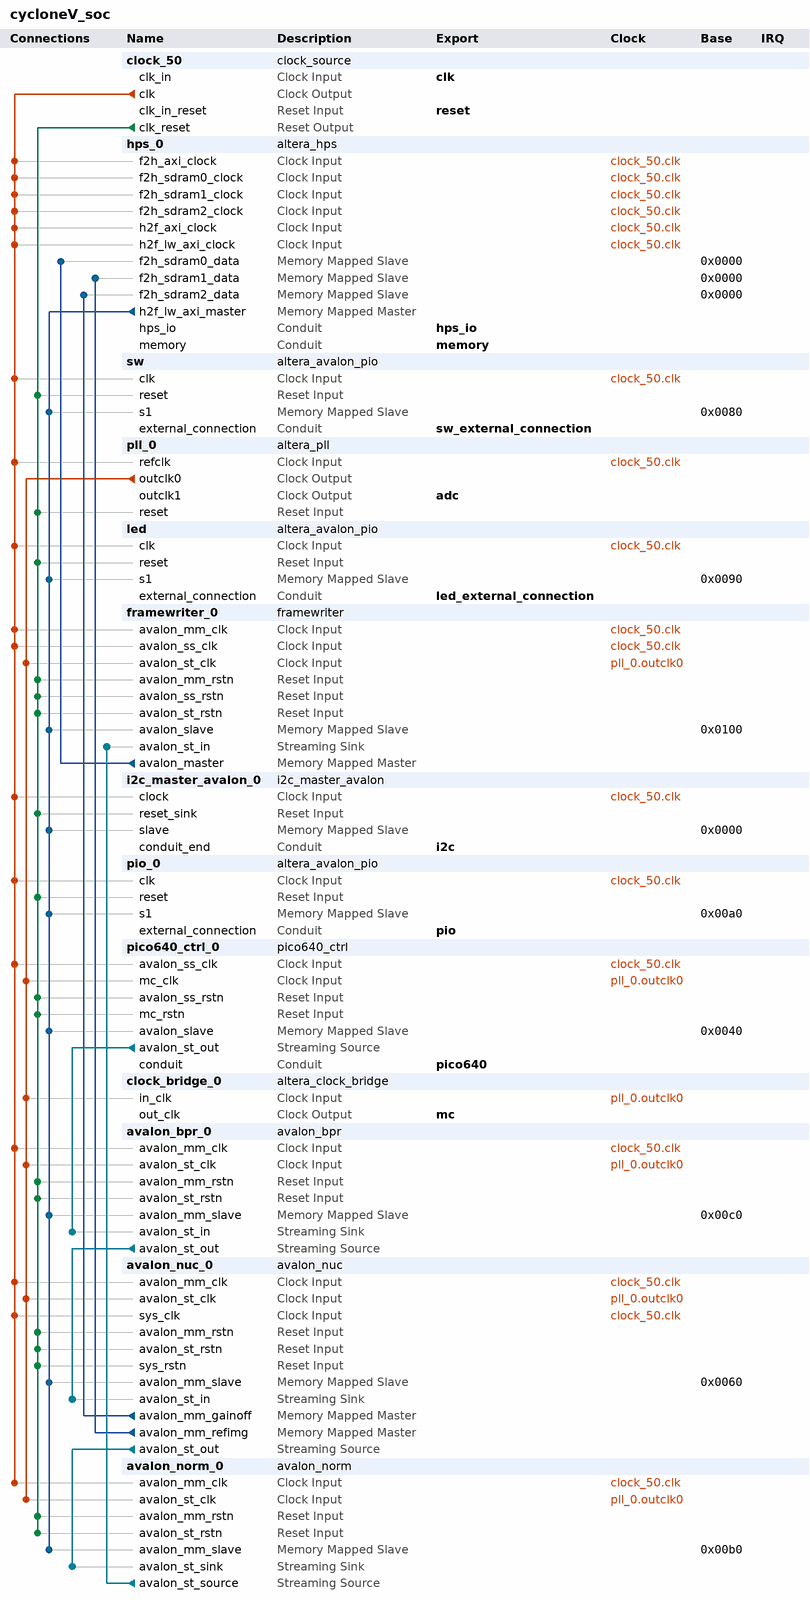
[diagram p0: system contents]
# Platform Designer (Qsys) system cycloneV_soc, Cyclone V 5CSEMA4U23C6
# Parameters at their usual value, and those the tool derives, are not listed.
package require -exact qsys 16.1
create_system cycloneV_soc
set_project_property DEVICE_FAMILY {Cyclone V}
set_project_property DEVICE 5CSEMA4U23C6

add_instance clock_50 clock_source 16.1
set_instance_parameter_value clock_50 clockFrequency 50000000

add_instance hps_0 altera_hps 16.1
set_instance_parameter_value hps_0 EMAC1_Mode RGMII
set_instance_parameter_value hps_0 EMAC1_PinMuxing {HPS I/O Set 0}
set_instance_parameter_value hps_0 F2SCLK_COLDRST_Enable false
set_instance_parameter_value hps_0 F2SCLK_DBGRST_Enable false
set_instance_parameter_value hps_0 F2SCLK_WARMRST_Enable false
set_instance_parameter_value hps_0 F2SDRAM_Type {Avalon-MM Write-Only,Avalon-MM Read-Only,Avalon-MM Read-Only}
set_instance_parameter_value hps_0 F2SDRAM_Width 64,64,64
set_instance_parameter_value hps_0 F2SINTERRUPT_Enable false
set_instance_parameter_value hps_0 F2S_Width 3
set_instance_parameter_value hps_0 FPGA_PERIPHERAL_OUTPUT_CLOCK_FREQ_EMAC0_GTX_CLK 100
set_instance_parameter_value hps_0 FPGA_PERIPHERAL_OUTPUT_CLOCK_FREQ_EMAC0_MD_CLK 100.0
set_instance_parameter_value hps_0 FPGA_PERIPHERAL_OUTPUT_CLOCK_FREQ_EMAC1_GTX_CLK 100
set_instance_parameter_value hps_0 FPGA_PERIPHERAL_OUTPUT_CLOCK_FREQ_EMAC1_MD_CLK 100.0
set_instance_parameter_value hps_0 HPS_PROTOCOL DDR3
set_instance_parameter_value hps_0 I2C0_Mode N/A
set_instance_parameter_value hps_0 I2C0_PinMuxing Unused
set_instance_parameter_value hps_0 I2C1_Mode N/A
set_instance_parameter_value hps_0 I2C1_PinMuxing Unused
set_instance_parameter_value hps_0 LWH2F_Enable true
set_instance_parameter_value hps_0 MEM_BANKADDR_WIDTH 3
set_instance_parameter_value hps_0 MEM_CLK_FREQ 400.0
set_instance_parameter_value hps_0 MEM_COL_ADDR_WIDTH 10
set_instance_parameter_value hps_0 MEM_DQ_WIDTH 32
set_instance_parameter_value hps_0 MEM_DRV_STR RZQ/7
set_instance_parameter_value hps_0 MEM_ROW_ADDR_WIDTH 15
set_instance_parameter_value hps_0 MEM_RTT_NOM RZQ/4
set_instance_parameter_value hps_0 MEM_RTT_WR {Dynamic ODT off}
set_instance_parameter_value hps_0 MEM_TCL 11
set_instance_parameter_value hps_0 MEM_TFAW_NS 30.0
set_instance_parameter_value hps_0 MEM_TRAS_NS 35.0
set_instance_parameter_value hps_0 MEM_TRCD_NS 13.75
set_instance_parameter_value hps_0 MEM_TRFC_NS 260.0
set_instance_parameter_value hps_0 MEM_TRP_NS 13.75
set_instance_parameter_value hps_0 MEM_VENDOR JEDEC
set_instance_parameter_value hps_0 MEM_WTCL 8
set_instance_parameter_value hps_0 QSPI_Mode N/A
set_instance_parameter_value hps_0 QSPI_PinMuxing Unused
set_instance_parameter_value hps_0 REF_CLK_FREQ 25.0
set_instance_parameter_value hps_0 S2FCLK_USER2CLK 5
set_instance_parameter_value hps_0 S2F_Width 2
set_instance_parameter_value hps_0 SDIO_Mode {4-bit Data}
set_instance_parameter_value hps_0 SDIO_PinMuxing {HPS I/O Set 0}
set_instance_parameter_value hps_0 SPIM1_Mode N/A
set_instance_parameter_value hps_0 SPIM1_PinMuxing Unused
set_instance_parameter_value hps_0 STM_Enable false
set_instance_parameter_value hps_0 TIMING_BOARD_AC_SKEW 0.03
set_instance_parameter_value hps_0 TIMING_BOARD_AC_TO_CK_SKEW 0.0
set_instance_parameter_value hps_0 TIMING_BOARD_DQ_TO_DQS_SKEW 0.0
set_instance_parameter_value hps_0 TIMING_BOARD_MAX_CK_DELAY 0.03
set_instance_parameter_value hps_0 TIMING_BOARD_MAX_DQS_DELAY 0.02
set_instance_parameter_value hps_0 TIMING_BOARD_SKEW_BETWEEN_DQS 0.08
set_instance_parameter_value hps_0 TIMING_BOARD_SKEW_CKDQS_DIMM_MAX 0.16
set_instance_parameter_value hps_0 TIMING_BOARD_SKEW_CKDQS_DIMM_MIN 0.09
set_instance_parameter_value hps_0 TIMING_BOARD_SKEW_WITHIN_DQS 0.01
set_instance_parameter_value hps_0 TIMING_TDH 65
set_instance_parameter_value hps_0 TIMING_TDQSCK 255
set_instance_parameter_value hps_0 TIMING_TDQSQ 125
set_instance_parameter_value hps_0 TIMING_TDS 30
set_instance_parameter_value hps_0 TIMING_TIH 140
set_instance_parameter_value hps_0 TIMING_TIS 180
set_instance_parameter_value hps_0 TIMING_TQSH 0.4
set_instance_parameter_value hps_0 UART0_Mode {No Flow Control}
set_instance_parameter_value hps_0 UART0_PinMuxing {HPS I/O Set 0}
set_instance_parameter_value hps_0 USB1_Mode SDR
set_instance_parameter_value hps_0 USB1_PinMuxing {HPS I/O Set 0}
set_instance_parameter_value hps_0 desired_cfg_clk_mhz 100.0
set_instance_parameter_value hps_0 desired_qspi_clk_mhz 400.0

add_instance sw altera_avalon_pio 16.1
set_instance_parameter_value sw direction Input
set_instance_parameter_value sw width 4

add_instance pll_0 altera_pll 16.1
set_instance_parameter_value pll_0 gui_device_speed_grade 2
set_instance_parameter_value pll_0 gui_number_of_clocks 2
set_instance_parameter_value pll_0 gui_operation_mode direct
set_instance_parameter_value pll_0 gui_output_clock_frequency0 38.0
set_instance_parameter_value pll_0 gui_output_clock_frequency1 19.0
set_instance_parameter_value pll_0 gui_phase_shift1 -9579
set_instance_parameter_value pll_0 gui_phase_shift_deg1 -12.0
set_instance_parameter_value pll_0 gui_pll_mode {Integer-N PLL}
set_instance_parameter_value pll_0 gui_ps_units1 degrees
set_instance_parameter_value pll_0 gui_reference_clock_frequency 50.0
set_instance_parameter_value pll_0 gui_use_locked false

add_instance led altera_avalon_pio 16.1
set_instance_parameter_value led direction Output
set_instance_parameter_value led width 8

add_instance framewriter_0 framewriter 1.0
set_instance_parameter_value framewriter_0 BURST_LENGTH_DEPTH 5
set_instance_parameter_value framewriter_0 CLOCK_FREQ 50000000
set_instance_parameter_value framewriter_0 FIFO_DEPTH 10
set_instance_parameter_value framewriter_0 NBITS_DATA 16

add_instance i2c_master_avalon_0 i2c_master_avalon 1.0
set_instance_parameter_value i2c_master_avalon_0 CHECK_ACK true
set_instance_parameter_value i2c_master_avalon_0 CLOCK_FREQ 50000000
set_instance_parameter_value i2c_master_avalon_0 I2C_CLK_FREQ 200000

add_instance pio_0 altera_avalon_pio 16.1
set_instance_parameter_value pio_0 direction Output
set_instance_parameter_value pio_0 width 8

add_instance pico640_ctrl_0 pico640_ctrl 1.0
set_instance_parameter_value pico640_ctrl_0 SENSOR_CLOCK 38000000

add_instance clock_bridge_0 altera_clock_bridge 16.1
set_instance_parameter_value clock_bridge_0 DERIVED_CLOCK_RATE 38000000
set_instance_parameter_value clock_bridge_0 EXPLICIT_CLOCK_RATE 12000000

add_instance avalon_bpr_0 avalon_bpr 1.0
set_instance_parameter_value avalon_bpr_0 MAXIMUM_BPS 1024
set_instance_parameter_value avalon_bpr_0 NBITS_DATA 16

add_instance avalon_nuc_0 avalon_nuc 1.0
set_instance_parameter_value avalon_nuc_0 ADDR_BASE_READ 939524096
set_instance_parameter_value avalon_nuc_0 BURST 32
set_instance_parameter_value avalon_nuc_0 DIV_APPROXIMATION true
set_instance_parameter_value avalon_nuc_0 FIFO_DEPTH_BITS 8
set_instance_parameter_value avalon_nuc_0 FRAME_SIZE 307200
set_instance_parameter_value avalon_nuc_0 NBITS_DATA 16

add_instance avalon_norm_0 avalon_norm 1.1
set_instance_parameter_value avalon_norm_0 FRAME_SIZE 307200
set_instance_parameter_value avalon_norm_0 HISTOGRAM_CAPABLE true
set_instance_parameter_value avalon_norm_0 HIST_ARRAY_BITS 6
set_instance_parameter_value avalon_norm_0 NBITS_DATA_IN 16
set_instance_parameter_value avalon_norm_0 NBITS_DATA_OUT 16
set_instance_parameter_value avalon_norm_0 NBITS_HISTOGRAM_DEPTH 19
set_instance_parameter_value avalon_norm_0 NORM_FSCALE_DEPTH 16
set_instance_parameter_value avalon_norm_0 NORM_MEMORY 16

# connections
add_connection clock_50.clk avalon_bpr_0.avalon_mm_clk clock
add_connection clock_50.clk avalon_norm_0.avalon_mm_clk clock
add_connection clock_50.clk avalon_nuc_0.avalon_mm_clk clock
add_connection clock_50.clk avalon_nuc_0.sys_clk clock
add_connection clock_50.clk framewriter_0.avalon_mm_clk clock
add_connection clock_50.clk framewriter_0.avalon_ss_clk clock
add_connection clock_50.clk hps_0.f2h_axi_clock clock
add_connection clock_50.clk hps_0.f2h_sdram0_clock clock
add_connection clock_50.clk hps_0.f2h_sdram1_clock clock
add_connection clock_50.clk hps_0.f2h_sdram2_clock clock
add_connection clock_50.clk hps_0.h2f_axi_clock clock
add_connection clock_50.clk hps_0.h2f_lw_axi_clock clock
add_connection clock_50.clk i2c_master_avalon_0.clock clock
add_connection clock_50.clk led.clk clock
add_connection clock_50.clk pico640_ctrl_0.avalon_ss_clk clock
add_connection clock_50.clk pio_0.clk clock
add_connection clock_50.clk pll_0.refclk clock
add_connection clock_50.clk sw.clk clock
add_connection pll_0.outclk0 avalon_bpr_0.avalon_st_clk clock
add_connection pll_0.outclk0 avalon_norm_0.avalon_st_clk clock
add_connection pll_0.outclk0 avalon_nuc_0.avalon_st_clk clock
add_connection pll_0.outclk0 clock_bridge_0.in_clk clock
add_connection pll_0.outclk0 framewriter_0.avalon_st_clk clock
add_connection pll_0.outclk0 pico640_ctrl_0.mc_clk clock
add_connection clock_50.clk_reset avalon_bpr_0.avalon_mm_rstn reset
add_connection clock_50.clk_reset avalon_bpr_0.avalon_st_rstn reset
add_connection clock_50.clk_reset avalon_norm_0.avalon_mm_rstn reset
add_connection clock_50.clk_reset avalon_norm_0.avalon_st_rstn reset
add_connection clock_50.clk_reset avalon_nuc_0.avalon_mm_rstn reset
add_connection clock_50.clk_reset avalon_nuc_0.avalon_st_rstn reset
add_connection clock_50.clk_reset avalon_nuc_0.sys_rstn reset
add_connection clock_50.clk_reset framewriter_0.avalon_mm_rstn reset
add_connection clock_50.clk_reset framewriter_0.avalon_ss_rstn reset
add_connection clock_50.clk_reset framewriter_0.avalon_st_rstn reset
add_connection clock_50.clk_reset i2c_master_avalon_0.reset_sink reset
add_connection clock_50.clk_reset led.reset reset
add_connection clock_50.clk_reset pico640_ctrl_0.avalon_ss_rstn reset
add_connection clock_50.clk_reset pico640_ctrl_0.mc_rstn reset
add_connection clock_50.clk_reset pio_0.reset reset
add_connection clock_50.clk_reset pll_0.reset reset
add_connection clock_50.clk_reset sw.reset reset
add_connection avalon_nuc_0.avalon_mm_gainoff hps_0.f2h_sdram2_data avalon
set_connection_parameter_value avalon_nuc_0.avalon_mm_gainoff/hps_0.f2h_sdram2_data baseAddress 0x0000
add_connection avalon_nuc_0.avalon_mm_refimg hps_0.f2h_sdram1_data avalon
set_connection_parameter_value avalon_nuc_0.avalon_mm_refimg/hps_0.f2h_sdram1_data baseAddress 0x0000
add_connection framewriter_0.avalon_master hps_0.f2h_sdram0_data avalon
set_connection_parameter_value framewriter_0.avalon_master/hps_0.f2h_sdram0_data baseAddress 0x0000
add_connection hps_0.h2f_lw_axi_master avalon_bpr_0.avalon_mm_slave avalon
set_connection_parameter_value hps_0.h2f_lw_axi_master/avalon_bpr_0.avalon_mm_slave baseAddress 0x00c0
add_connection hps_0.h2f_lw_axi_master avalon_norm_0.avalon_mm_slave avalon
set_connection_parameter_value hps_0.h2f_lw_axi_master/avalon_norm_0.avalon_mm_slave baseAddress 0x00b0
add_connection hps_0.h2f_lw_axi_master avalon_nuc_0.avalon_mm_slave avalon
set_connection_parameter_value hps_0.h2f_lw_axi_master/avalon_nuc_0.avalon_mm_slave baseAddress 0x0060
add_connection hps_0.h2f_lw_axi_master framewriter_0.avalon_slave avalon
set_connection_parameter_value hps_0.h2f_lw_axi_master/framewriter_0.avalon_slave baseAddress 0x0100
add_connection hps_0.h2f_lw_axi_master i2c_master_avalon_0.slave avalon
set_connection_parameter_value hps_0.h2f_lw_axi_master/i2c_master_avalon_0.slave baseAddress 0x0000
add_connection hps_0.h2f_lw_axi_master led.s1 avalon
set_connection_parameter_value hps_0.h2f_lw_axi_master/led.s1 baseAddress 0x0090
add_connection hps_0.h2f_lw_axi_master pico640_ctrl_0.avalon_slave avalon
set_connection_parameter_value hps_0.h2f_lw_axi_master/pico640_ctrl_0.avalon_slave baseAddress 0x0040
add_connection hps_0.h2f_lw_axi_master pio_0.s1 avalon
set_connection_parameter_value hps_0.h2f_lw_axi_master/pio_0.s1 baseAddress 0x00a0
add_connection hps_0.h2f_lw_axi_master sw.s1 avalon
set_connection_parameter_value hps_0.h2f_lw_axi_master/sw.s1 baseAddress 0x0080
add_connection avalon_bpr_0.avalon_st_out avalon_nuc_0.avalon_st_in avalon_streaming
add_connection avalon_norm_0.avalon_st_source framewriter_0.avalon_st_in avalon_streaming
add_connection avalon_nuc_0.avalon_st_out avalon_norm_0.avalon_st_sink avalon_streaming
add_connection pico640_ctrl_0.avalon_st_out avalon_bpr_0.avalon_st_in avalon_streaming

# exported interfaces
add_interface adc clock source
set_interface_property adc EXPORT_OF pll_0.outclk1
add_interface clk clock sink
set_interface_property clk EXPORT_OF clock_50.clk_in
add_interface hps_io conduit end
set_interface_property hps_io EXPORT_OF hps_0.hps_io
add_interface i2c conduit end
set_interface_property i2c EXPORT_OF i2c_master_avalon_0.conduit_end
add_interface led_external_connection conduit end
set_interface_property led_external_connection EXPORT_OF led.external_connection
add_interface mc clock source
set_interface_property mc EXPORT_OF clock_bridge_0.out_clk
add_interface memory conduit end
set_interface_property memory EXPORT_OF hps_0.memory
add_interface pico640 conduit end
set_interface_property pico640 EXPORT_OF pico640_ctrl_0.conduit
add_interface pio conduit end
set_interface_property pio EXPORT_OF pio_0.external_connection
add_interface reset reset sink
set_interface_property reset EXPORT_OF clock_50.clk_in_reset
add_interface sw_external_connection conduit end
set_interface_property sw_external_connection EXPORT_OF sw.external_connection

set_interconnect_requirement {$system} qsys_mm.clockCrossingAdapter HANDSHAKE
set_interconnect_requirement {$system} qsys_mm.insertDefaultSlave FALSE
set_interconnect_requirement {$system} qsys_mm.maxAdditionalLatency 1

save_system cycloneV_soc.qsys
